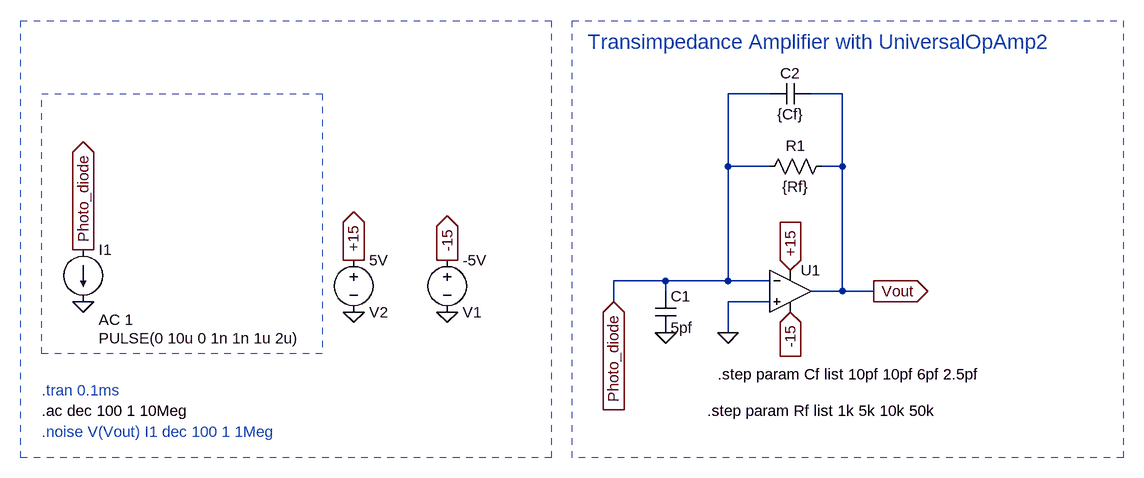
[diagram p0: schematic Transimpedance Amplifier with UniversalOpAmp2.asc]
Transimpedance Amplifier with UniversalOpAmp2.asc, the LTspice schematic file:
Version 4
SHEET 1 880 680
WIRE 176 -144 112 -144
WIRE 288 -144 240 -144
WIRE 112 -32 112 -144
WIRE 176 -32 112 -32
WIRE 288 -32 288 -144
WIRE 288 -32 256 -32
WIRE 16 144 -64 144
WIRE 112 144 112 -32
WIRE 112 144 16 144
WIRE 176 144 112 144
WIRE 16 160 16 144
WIRE 288 160 288 -32
WIRE 288 160 240 160
WIRE 336 160 288 160
WIRE -64 176 -64 144
WIRE 176 176 112 176
WIRE 112 224 112 176
FLAG -320 192 0
FLAG -464 192 0
FLAG -880 176 0
FLAG 16 224 0
FLAG 112 224 0
FLAG -320 112 -15
IOPIN -320 112 Out
FLAG 208 192 -15
IOPIN 208 192 In
FLAG 208 128 +15
IOPIN 208 128 In
FLAG -464 112 +15
IOPIN -464 112 Out
FLAG -880 96 Photo_diode
IOPIN -880 96 Out
FLAG -64 176 Photo_diode
IOPIN -64 176 In
FLAG 336 160 Vout
IOPIN 336 160 Out
SYMBOL OpAmps\\UniversalOpAmp2 208 160 R0
SYMATTR InstName U1
SYMBOL voltage -320 96 R0
WINDOW 0 24 96 Left 2
WINDOW 3 24 16 Left 2
WINDOW 123 0 0 Left 0
WINDOW 39 0 0 Left 0
SYMATTR InstName V1
SYMATTR Value -5V
SYMBOL voltage -464 96 R0
WINDOW 0 24 96 Left 2
WINDOW 3 24 16 Left 2
WINDOW 123 0 0 Left 0
WINDOW 39 0 0 Left 0
SYMATTR InstName V2
SYMATTR Value 5V
SYMBOL current -880 96 R0
WINDOW 123 24 108 Left 2
WINDOW 39 0 0 Left 0
WINDOW 3 24 136 Left 2
SYMATTR Value2 AC 1
SYMATTR Value PULSE(0 10u 0 1n 1n 1u 2u)
SYMATTR InstName I1
SYMBOL cap 0 160 R0
SYMATTR InstName C1
SYMATTR Value 5pf
SYMBOL res 272 -48 R90
WINDOW 0 0 56 VBottom 2
WINDOW 3 32 56 VTop 2
SYMATTR InstName R1
SYMATTR Value {Rf}
SYMBOL cap 240 -160 R90
WINDOW 0 0 32 VBottom 2
WINDOW 3 32 32 VTop 2
SYMATTR InstName C2
SYMATTR Value {Cf}
TEXT -944 312 Left 2 ;.tran 0.1ms
TEXT -944 344 Left 2 !.ac dec 100 1 10Meg
TEXT -944 376 Left 2 ;.noise V(Vout) I1 dec 100 1 1Meg
TEXT -104 -224 Left 3 ;Transimpedance Amplifier with UniversalOpAmp2
TEXT 80 344 Left 2 !.step param Rf list 1k 5k 10k 50k
TEXT 96 288 Left 2 !.step param Cf list 10pf 10pf 6pf 2.5pf
RECTANGLE Normal -160 416 -976 -256 2
RECTANGLE Normal -512 256 -944 -144 3
RECTANGLE Normal 720 416 -128 -256 2

The netlist it stands for:
* Transimpedance Amplifier with UniversalOpAmp2.asc
XU1 0 Photo_diode +15 -15 Vout level2 Avol=1Meg GBW=10Meg Slew=10Meg Ilimit=25m Rail=0 Vos=0 En=0 Enk=0 In=0 Ink=0 Rin=500Meg  ; pins In+ In- V+ V- OUT
V1 -15 0 -5V
V2 +15 0 5V
I1 Photo_diode 0 PULSE(0 10u 0 1n 1n 1u 2u) AC 1
C1 Photo_diode 0 5pf
R1 Vout Photo_diode {Rf}
C2 Vout Photo_diode {Cf}
* .tran 0.1ms
.ac dec 100 1 10Meg
* .noise V(Vout) I1 dec 100 1 1Meg
* Transimpedance Amplifier with UniversalOpAmp2
.step param Rf list 1k 5k 10k 50k
.step param Cf list 10pf 10pf 6pf 2.5pf
.lib UniversalOpAmp2.lib
.backanno
.end